# Altium schematic sheet PowerStudent.SchDoc: Лабы ЦОС
size 420 x 297 mm; DrawnBy: Подлесный; SheetNumber: 1; SheetTotal: 5; DocumentType: Схема электрическая принципиальная; Format: A3; ImagePath: Введите номер платы
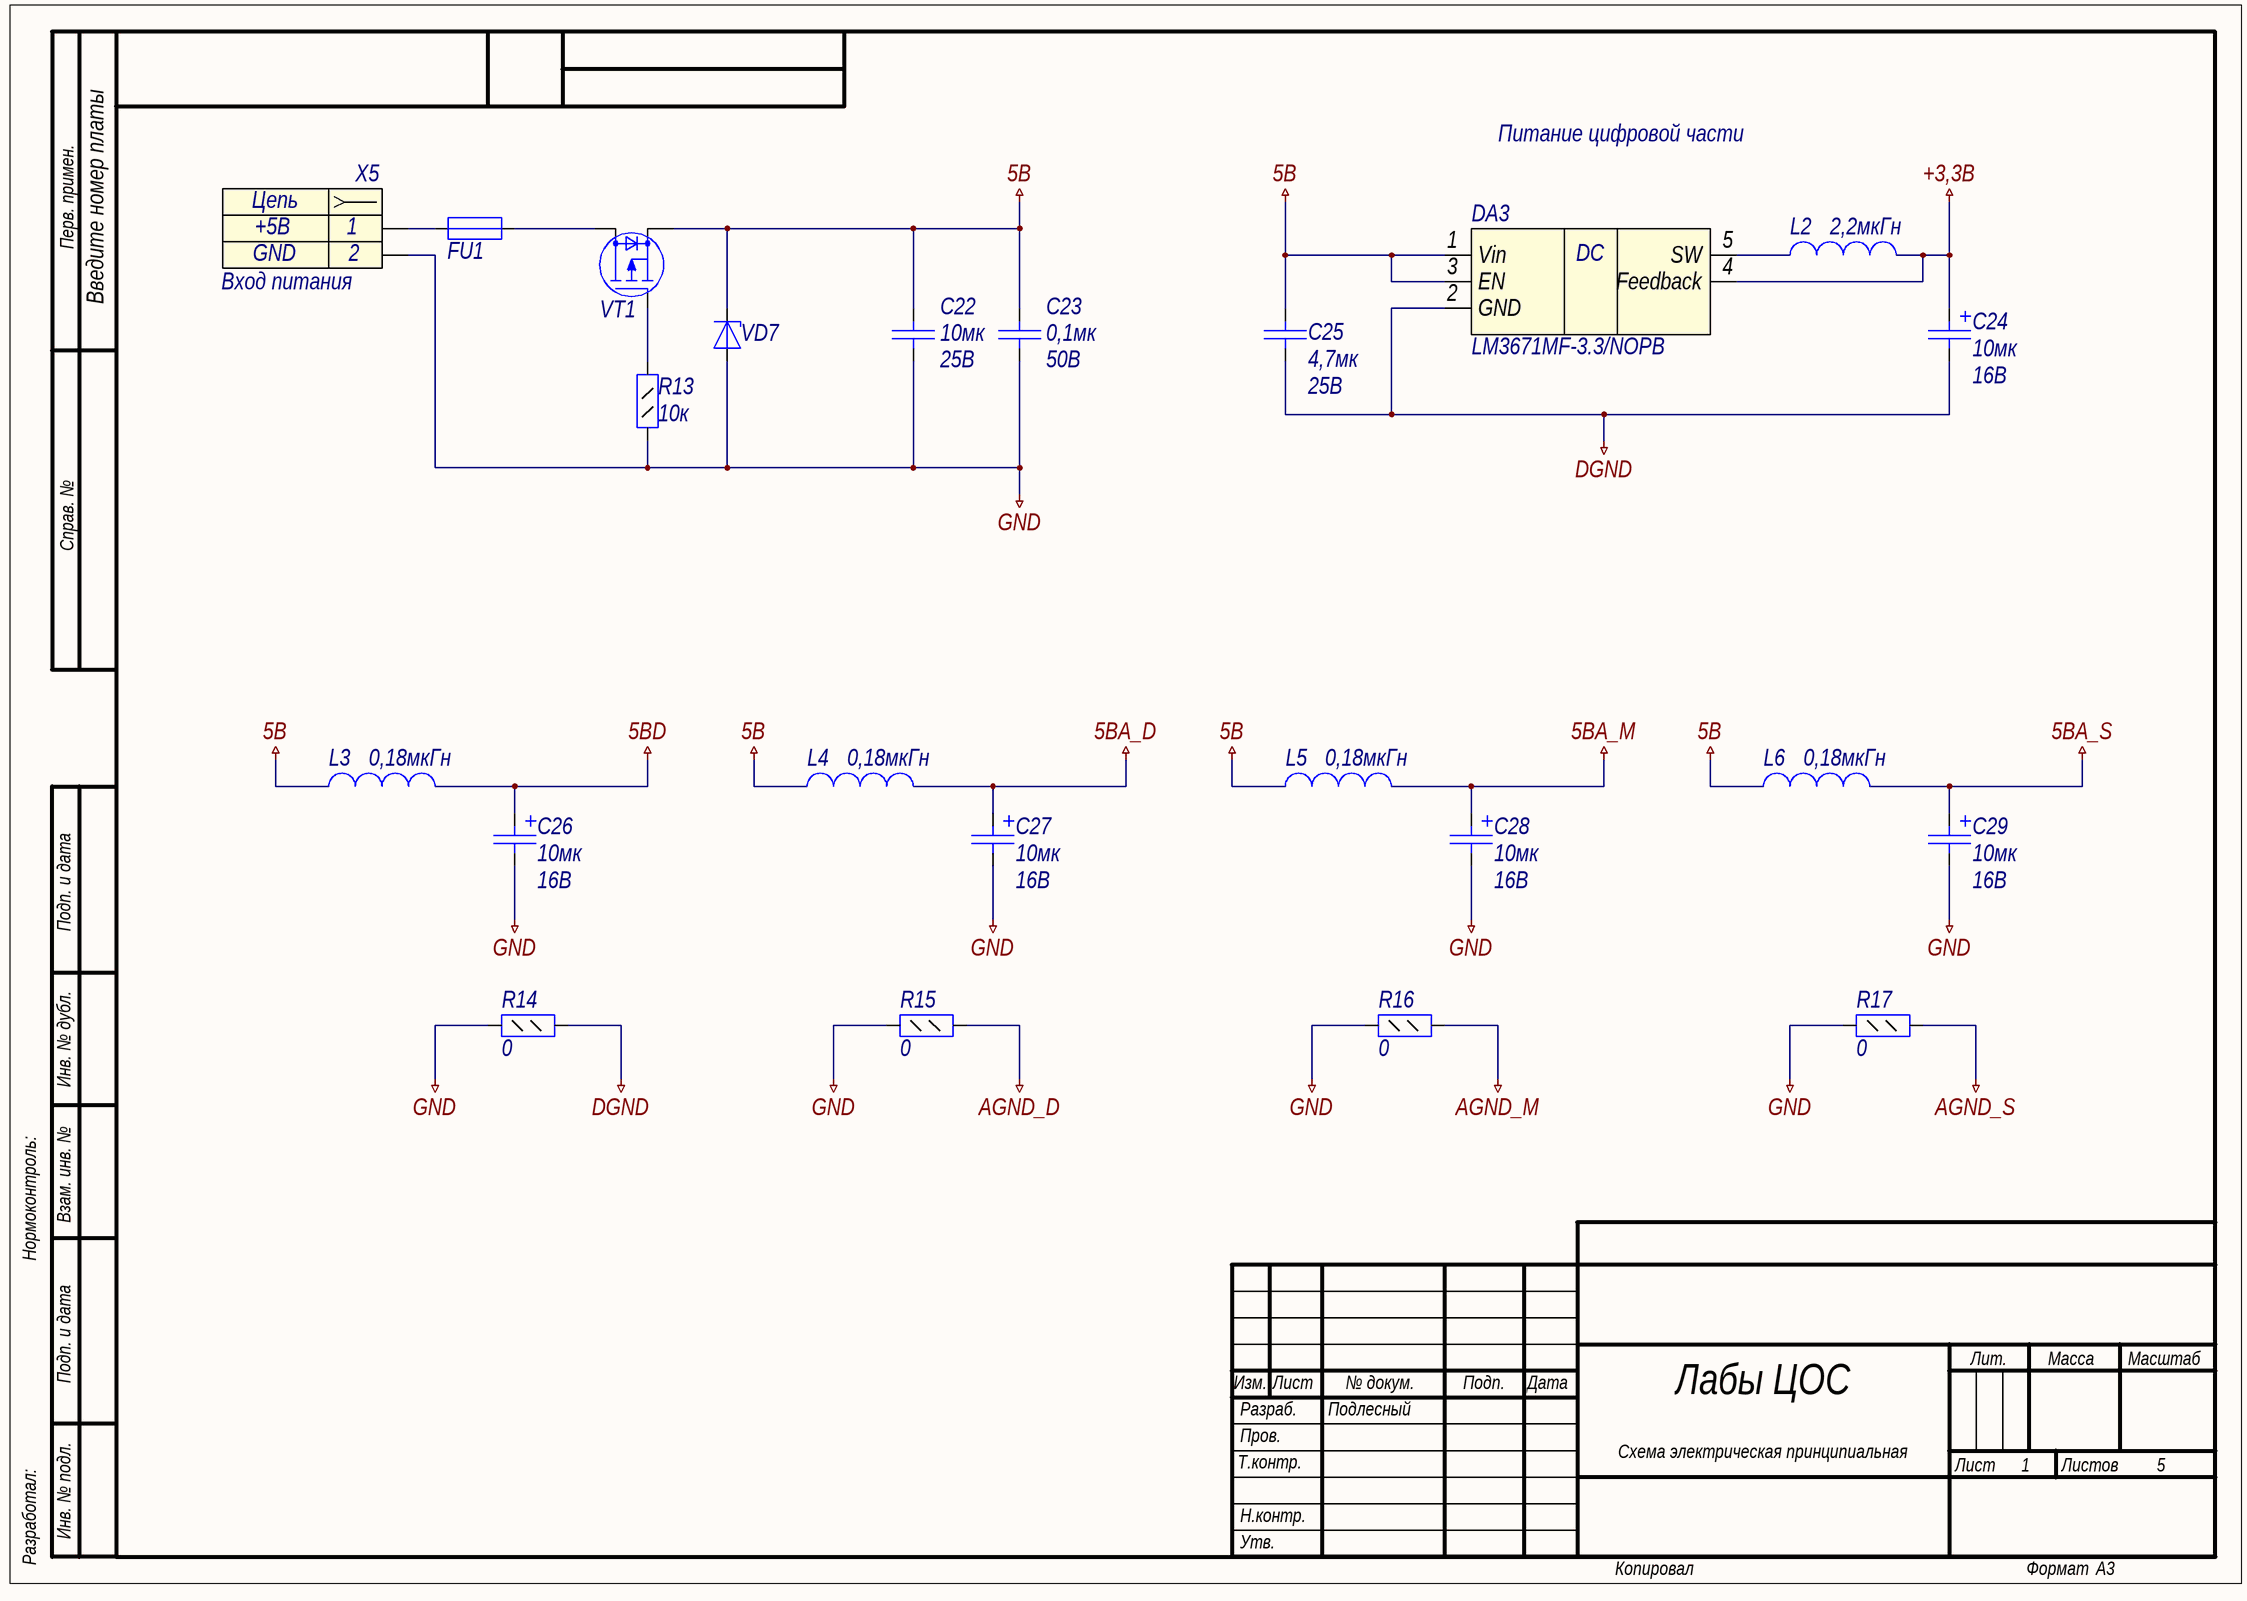
[diagram p0: PowerStudent.SchDoc]

## Parts
C22  value 10мк  Voltage: 25В  [C1206]  (hidden comment: Capacitor)
C23  value 0,1мк  Voltage: 50В  [C0805]  (hidden comment: Capacitor)
C24  value 10мк  Voltage: 16В  [TANTAL CASE A]  (hidden comment: Capacitor_pol)
C25  value 4,7мк  Voltage: 25B  [C0805]  (hidden comment: Capacitor)
C26  value 10мк  Voltage: 16В  [TANTAL CASE A]  (hidden comment: Capacitor_pol)
C27  value 10мк  Voltage: 16В  [TANTAL CASE A]  (hidden comment: Capacitor_pol)
C28  value 10мк  Voltage: 16В  [TANTAL CASE A]  (hidden comment: Capacitor_pol)
C29  value 10мк  Voltage: 16В  [TANTAL CASE A]  (hidden comment: Capacitor_pol)
DA3  Part Number: LM3671MF-3.3/NOPB  [SOT23-5]  (hidden comment: LM3671MF)
FU1  Fuse  [FUSE812]  (value not drawn)
L2  value 2,2мкГн  [SDR0604]  (hidden comment: Inductor)
L3  value 0,18мкГн  [L0805]  (hidden comment: Inductor)
L4  value 0,18мкГн  [L0805]  (hidden comment: Inductor)
L5  value 0,18мкГн  [L0805]  (hidden comment: Inductor)
L6  value 0,18мкГн  [L0805]  (hidden comment: Inductor)
R13  value 10к  [R0805]  (hidden comment: Resistor_0,125Вт)
R14  value 0  [R0805]  (hidden comment: Resistor_0,125Вт)
R15  value 0  [R0805]  (hidden comment: Resistor_0,125Вт)
R16  value 0  [R0805]  (hidden comment: Resistor_0,125Вт)
R17  value 0  [R0805]  (hidden comment: Resistor_0,125Вт)
VD7  DiodeZener  [SMA]  (value not drawn)
VT1  P-MOSFET  [SOT23-3]  (value not drawn)
X5  Вход питания  [DS-210]

## Nets
5B: C22.2 C23.2 C25.2 DA3.1(Vin) DA3.3(EN) L3.1 L4.1 L5.1 L6.1 VD7.1(K) VT1.2(S)
5BA_D: C27.1 L4.2
5BA_M: C28.1 L5.2
5BA_S: C29.1 L6.2
5BD: C26.1 L3.2
+3,3В: C24.1 DA3.4(Feedback) L2.2
AGND_D: R15.2
AGND_M: R16.2
AGND_S: R17.2
DGND: C24.2 C25.1 DA3.2(GND) R14.2
GND: C22.1 C23.1 C26.2 C27.2 C28.2 C29.2 R13.1 R14.1 R15.1 R16.1 R17.1 VD7.2(A) X5.2
NetDA3_5: DA3.5(SW) L2.1
NetFU1_1: FU1.1 X5.1
NetFU1_2: FU1.2 VT1.3(D)
NetR13_2: R13.2 VT1.1(G)

## Notes on the sheet
- Перв. примен.
- Питание цифровой части
- Справ. №
- Подп. и дата
- Инв. № дубл.
- Нормоконтроль:
- Взам. инв. №
- Изм.
- Лист
- № докум.
- Подп.
- Дата
- Лит.
- Масса
- Масштаб
- Т.контр.
- Пров.
- Разраб.
- Листов
- Разработал:
- Инв. № подл.
- Н.контр.
- Утв.
- Копировал
- Формат
- (in symbol connect1) Цепь
- (in symbol pwr2) DC

## Library data of the parts
C22 = cap186: Конденсатор; Part Name: Ceramic; Manufacture: Murata; Part Number: GRM31CR71E106KA12L*; id: cap186; TKE: X7R
C23 = cap160: Конденсатор; Part Name: Ceramic; Manufacture: Murata; Part Number: GRM21BR71H104KA01L; id: cap160; TKE: X7R
C24 C26-C29 = cap199: Конденсатор полярный; Part Name: Tantal; Manufacture: Vishay; Part Number: 293D106X9016A2TE3; id: cap199
C25 = cap153: Конденсатор; Part Name: Ceramic; Manufacture: Murata; Part Number: GRM21BR61E475KA12L; id: cap153; TKE: X5R
DA3 = pwr2: Step-Down DC-DC Converter; Part Name: 600-mA Step-Down DC-DC Converter; Manufacturer: Texas Instruments; id: pwr2; Input Voltage: 2,7 - 5,5B; Output Voltage: 3,3B; Current: 0,6A; Type: Impulse
FU1 = fuse0: Предохранитель; Part Name: Resettable Fuses; Manufacture: Bourns; Part Number: MF-MSMF075; id: fuse0; V max: 13,2B; I max: 100A; I hold: 0,75A; I trip: 1,5A; Resistance: 0,45Ohms
L2 = ind34: EMI Suppression Filter; Part Name: SMD Power Inductors; Part Number: SDR0604-2R2ML; Manufacture: Bourns; Rated Current: 2,8A; id: ind34; Saturation Current: 5,1A; Resistance: 0,06Ohm
L3-L6 = ind2: EMI Suppression Filter; Part Number: CM201212-R18KL; Rated Current: 120-540мА; id: ind2; Part Name: Inductor
R13 = res97: Резистор; Manufacture: Yageo; Part Number: RC0805FR-0710KL; id: res97; Accuracy: 0.01; Part Name: Resistor; Power: 0,125Вт
R14-R17 = res0: Резистор; Manufacture: Yageo; Part Number: RC0805FR-070RL; id: res0; Accuracy: 0.01; Part Name: Resistor; Power: 0,125Вт
VD7 = SMAJ5.0A-TR: Cтабилитрон (лавинный выпрямительный диод) односторонний; Part Name: TVS diode Unidirectional; Manufacture: ST Microelectronics; id: tvs155; Leakage Current: 0,2uA; Stand-off Voltage: 5B; Breakdown Voltage: 6,74B; Clamping voltage: 13,4B; Dynamic resistance: 49Ohm; Peak Pulse Power: 400W; Number of diodes: 1; Part Number: SMAJ5.0A-TR
VT1 = mosfet3: N-MOSFET; Part Number: IRLML6401TRPBF; Part Name: Transistor; Structure: p-channel; V drain-source max: (-12B); Rds: 0,05Ohm; Gate-to-source voltage: (+-)8B; Continuous drain current: 4,3A; Pulsed drain current: 34A; Power dissipation: 1,3W; id: mosfet3
X5 = connect1: Разъем - 2 конт. розетка; Part Name: DC Power Jack; Part Number: DS-210B(PBT)(NB); Contact_1: +5В; Contact_2: GND; id: connect1